# EAGLE design relay (EAGLE 9.6.2)
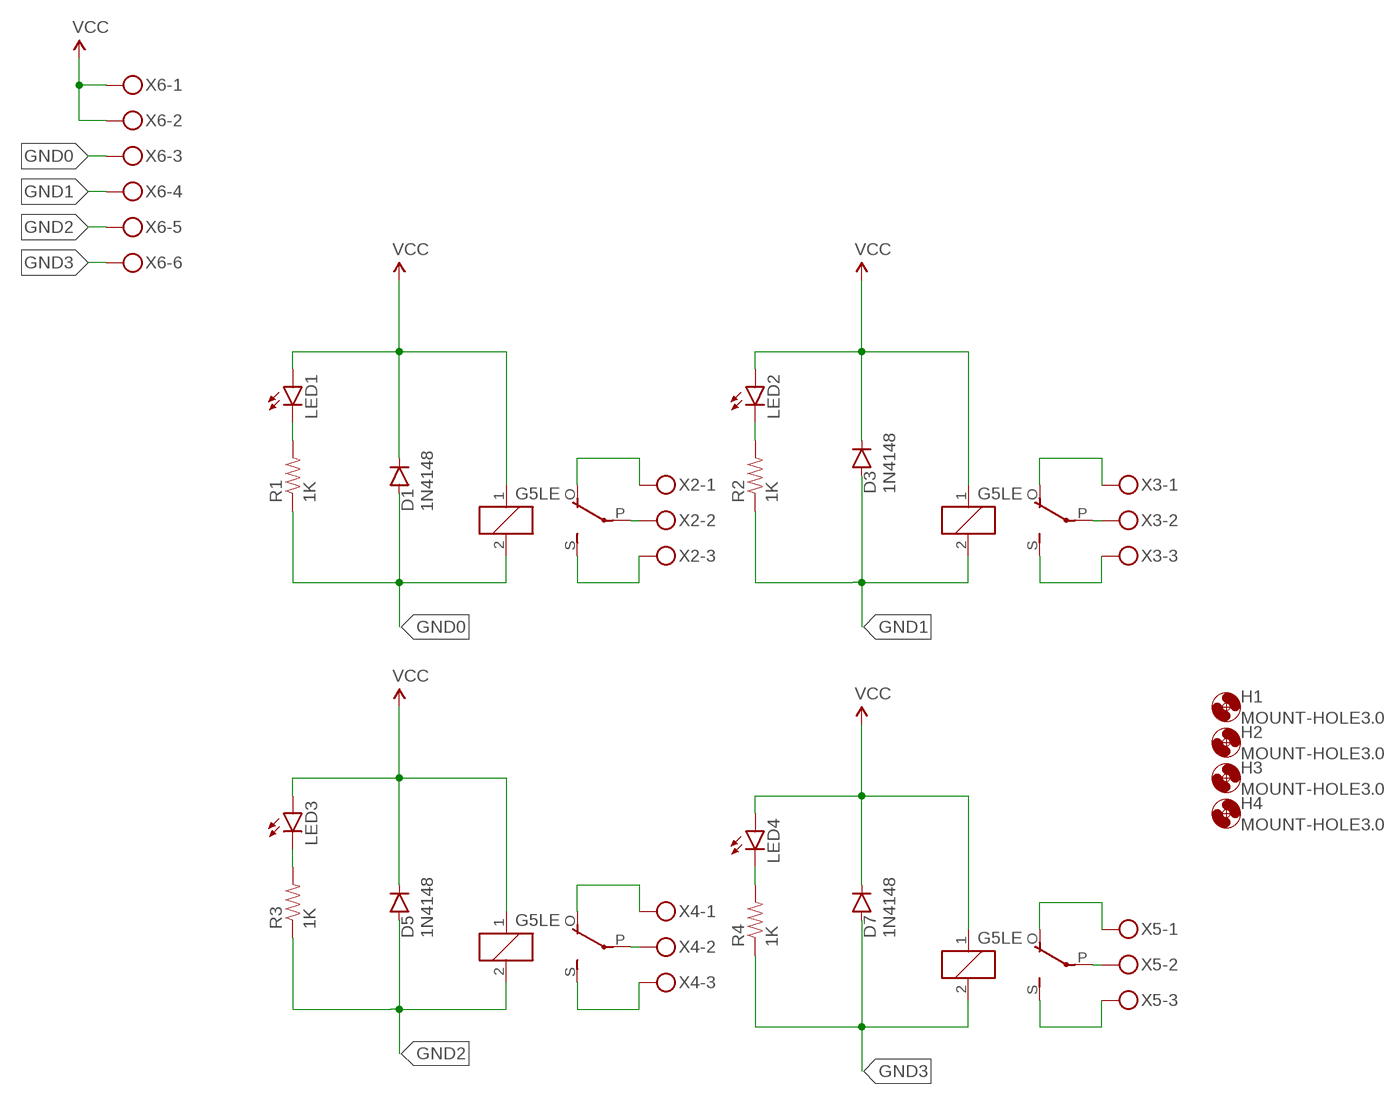
[diagram p0: schematic, sheet 1]

## Parts
D1  1N4148  DIODEKIT  [DIODE-1N4148-KIT]
D3  1N4148  DIODEKIT  [DIODE-1N4148-KIT]
D5  1N4148  DIODEKIT  [DIODE-1N4148-KIT]
D7  1N4148  DIODEKIT  [DIODE-1N4148-KIT]
H1  MOUNT-HOLE3.0  [3,0]
H2  MOUNT-HOLE3.0  [3,0]
H3  MOUNT-HOLE3.0  [3,0]
H4  MOUNT-HOLE3.0  [3,0]
K1  G5LE  [G5LE]
K2  G5LE  [G5LE]
K3  G5LE  [G5LE]
K4  G5LE  [G5LE]
LED1  LED3MM  [LED3MM]
LED2  LED3MM  [LED3MM]
LED3  LED3MM  [LED3MM]
LED4  LED3MM  [LED3MM]
R1  1K  1KOHM-1/4W-1%(PTH)HORIZ-KIT  [AXIAL-0.3EZ]
R2  1K  1KOHM-1/4W-1%(PTH)HORIZ-KIT  [AXIAL-0.3EZ]
R3  1K  1KOHM-1/4W-1%(PTH)HORIZ-KIT  [AXIAL-0.3EZ]
R4  1K  1KOHM-1/4W-1%(PTH)HORIZ-KIT  [AXIAL-0.3EZ]
X2  MKDSN1,5/3-5,08  [MKDSN1,5/3-5,08]
X3  MKDSN1,5/3-5,08  [MKDSN1,5/3-5,08]
X4  MKDSN1,5/3-5,08  [MKDSN1,5/3-5,08]
X5  MKDSN1,5/3-5,08  [MKDSN1,5/3-5,08]
X6  MKDSN1,5/6-5,08  [MKDSN1,5/6-5,08]

## Nets
GND0: D1.A K2.2 R1.P$1 X6.3
GND1: D3.A K1.2 R2.P$1 X6.4
GND2: D5.A K3.2 R3.P$1 X6.5
GND3: D7.A K4.2 R4.P$1 X6.6
N$1: K2.P(2:P) X2.2
N$2: K2.S(2:S) X2.3
N$3: K2.O(2:O) X2.1
N$4: LED2.K(C) R2.P$2
N$5: K1.P(2:P) X3.2
N$6: K1.S(2:S) X3.3
N$7: K1.O(2:O) X3.1
N$8: LED3.K(C) R3.P$2
N$9: LED1.K(C) R1.P$2
N$10: K3.P(2:P) X4.2
N$11: K3.S(2:S) X4.3
N$12: K3.O(2:O) X4.1
N$13: LED4.K(C) R4.P$2
N$14: K4.P(2:P) X5.2
N$15: K4.S(2:S) X5.3
N$16: K4.O(2:O) X5.1
VCC: D1.C D3.C D5.C D7.C K1.1 K2.1 K3.1 K4.1 LED1.A LED2.A LED3.A LED4.A X6.1 X6.2

## Library data of the parts
D1 D3 D5 D7 = SparkFun-DiscreteSemi:DIODE: Diode These are standard reverse protection diodes and small signal diodes. SMA package can handle up to about 1A. SOD-323 can handle about 200mA. What the SOD-323 package when ordering, there are some mfgs out there that are 5-pin packages.; PROD_ID: DIO-08378
H1-H4 = holes:MOUNT-HOLE: MOUNTING HOLE with drill center marker
K1-K4 = relay:G5LE: RELAY 1 x switch, 10 A/120 V AC, 8 A/30 V DC, Omron; OC_FARNELL: unknown; OC_NEWARK: unknown
LED1-LED4 = led:LED: LED OSRAM: - CHIPLED LG R971, LG N971, LY N971, LG Q971, LY Q971, LO R971, LY R971 LH N974, LH R974 LS Q976, LO Q976, LY Q976 LO Q996 - Hyper CHIPLED LW Q18S LB Q993, LB Q99A, LB R99A - SideLED LS A670, LO A670, LY A670, LG A670, LP A670 LB A673, LV A673, LT A673, LW A673 LH A674 LY A675 LS A676, LA A676, LO A676, LY A676, LW A676 LS A679, LY A679, LG A679 - Hyper Micro SIDELED® LS Y876, LA Y876, LO Y876, LY Y876 LT Y87S - SmartLED LW L88C, LW L88S LB L89C, LB L89S, LG L890 LS L89K, LO L89K, LY L89K LS L896, LA L896, LO L896, LY L896 - TOPLED LS T670, LO T670, LY T670, LG T670, LP T670 LSG T670, LSP T670, LSY T670, LOP T670, LYG T670 LG T671, LOG T671, LSG T671 LB T673, LV T673, LT T673, LW T673 LH T674 LS T676, LA T676, LO T676, LY T676, LB T676, LH T676, LSB T676, LW T676 LB T67C, LV T67C, LT T67C, LS T67K, LO T67K, LY T67K, LW E67C LS E67B, LA E67B, LO E67B, LY E67B, LB E67C, LV E67C, LT E67C LW T67C LS T679, LY T679, LG T679 LS T770, LO T770, LY T770, LG T770, LP T770 LB T773, LV T773, LT T773, LW T773 LH T774 LS E675, LA E675, LY E675, LS T675 LS T776, LA T776, LO T776, LY T776, LB T776 LHGB T686 LT T68C, LB T68C - Hyper Mini TOPLED® LB M676 - Mini TOPLED Santana® LG M470 LS M47K, LO M47K, LY M47K Source: http://www.osram.convergy.de LUXEON: - LUMILED® LXK2-PW12-R00, LXK2-PW12-S00, LXK2-PW14-U00, LXK2-PW14-V00 LXK2-PM12-R00, LXK2-PM12-S00, LXK2-PM14-U00 LXK2-PE12-Q00, LXK2-PE12-R00, LXK2-PE12-S00, LXK2-PE14-T00, LXK2-PE14-U00 LXK2-PB12-K00, LXK2-PB12-L00, LXK2-PB12-M00, LXK2-PB14-N00, LXK2-PB14-P00, LXK2-PB14-Q00 LXK2-PR12-L00, LXK2-PR12-M00, LXK2-PR14-Q00, LXK2-PR14-R00 LXK2-PD12-Q00, LXK2-PD12-R00, LXK2-PD12-S00 LXK2-PH12-R00, LXK2-PH12-S00 LXK2-PL12-P00, LXK2-PL12-Q00, LXK2-PL12-R00 Source: www.luxeon.com KINGBRIGHT: KA-3528ASYC Source: www.kingbright.com; PROD_ID: DIO-09529
R1-R4 = SparkFun-Resistors:1KOHM-1/4W-1%(PTH): RES-12182; PROD_ID: RES-12182
X2-X5 = con-phoenix-508:MKDSN1,5/3-5,08: MKDSN 1,5/ 3-5,08 Printklemme Nennstrom: 13,5 A Nennspannung: 250 V Rastermaß: 5,08 mm Polzahl: 3 Anschlussart: Schraubanschluss Montage: Löten Anschlussrichtung Leiter/Platine: 0 ° Artikelnummer: 1729131 Source: http://eshop.phoenixcontact.com .. 1729131.pdf
X6 = con-phoenix-508:MKDSN1,5/6-5,08: MKDSN 1,5/ 6-5,08 Printklemme Nennstrom: 13,5 A Nennspannung: 250 V Rastermaß: 5,08 mm Polzahl: 6 Anschlussart: Schraubanschluss Montage: Löten Anschlussrichtung Leiter/Platine: 0 ° Artikelnummer: 1729160 Source: http://eshop.phoenixcontact.com .. 1729160.pdf

## Board
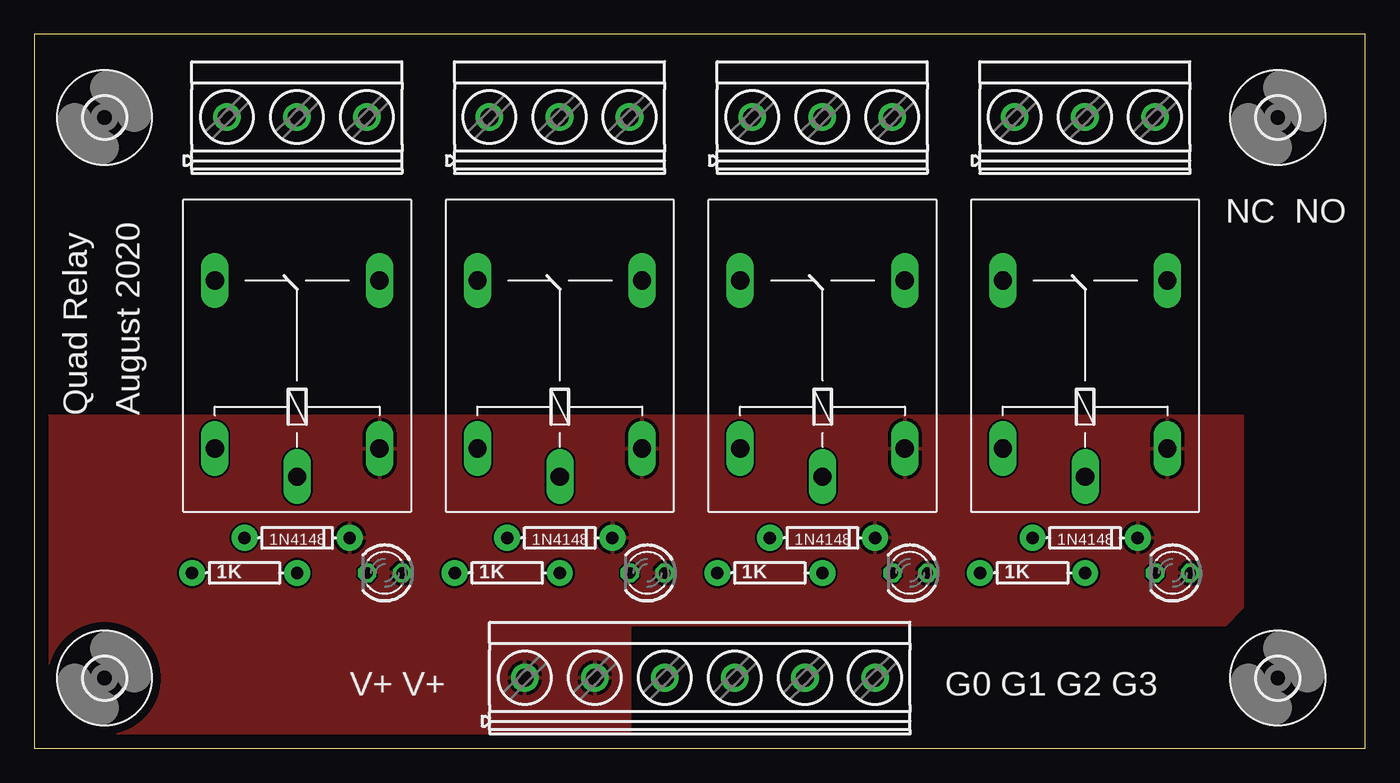
[diagram p1: board, top side]
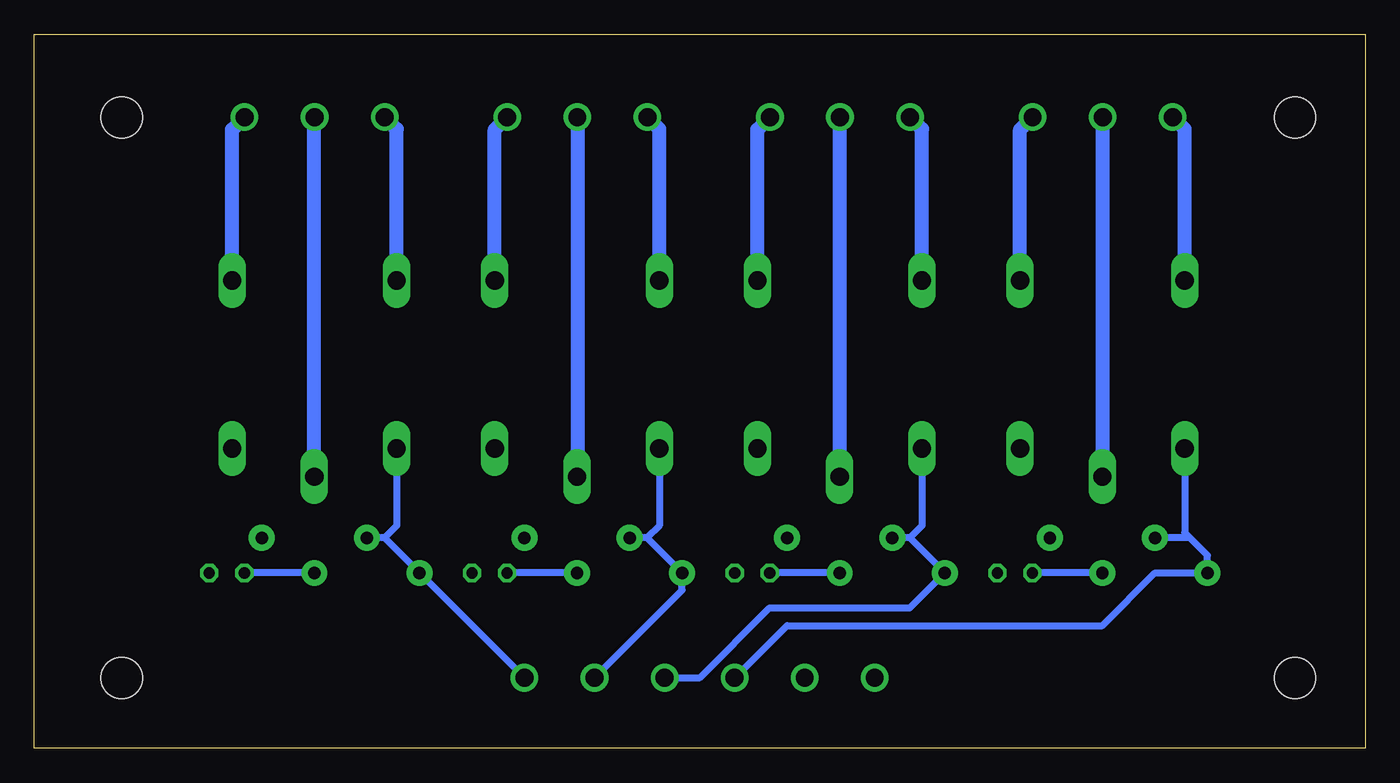
[diagram p2: board, bottom side, seen from below]

Size 96.5 x 51.74 mm. Coordinates in mm from the lower left corner, seen from the top.
Outline: 0,0 96.5,0 96.5,51.74 0,51.74 0,0
Copper layers (1*16): Top 0.035mm / dielectric 1.5mm / Bottom 0.035mm
Design rules "default": minimum track width 6mil, minimum drill 0.35mm, track to track 6mil, track to pad 6mil, pad to pad 6mil, via to via 6mil, smd to smd 6mil, copper to edge 40mil, drill to drill 6mil, minimum pad ring 10mil, minimum via ring 8mil, stop-mask expansion 4mil, vias tented up to drill 0mil, thermal gap 10mil

### Footprints (pad centres in the part's own frame; a part is rotated, then mirrored left to right if it is on the bottom)
DIODE-1N4148-KIT = drill 0.9 pad 1.88: A -3.81,0; C 3.81,0
3,0 = hole 3: 0,0
G5LE = drill 1.321 long: 1 -7.493,-5.969; 2 -7.493,5.969; O 4.699,5.969; P -9.525,0; S 4.699,-5.969
LED3MM = drill 0.813 octagon: A -1.27,0; K 1.27,0
AXIAL-0.3EZ = drill 0.9 pad 1.88: P$1 -3.81,0; P$2 3.81,0
MKDSN1,5/3-5,08 = drill 1.3 pad 2: 1 -7.641,0.025; 2 -2.561,0.025; 3 2.519,0.025
MKDSN1,5/6-5,08 = drill 1.3 pad 2: 1 -12.7,0.025; 2 -7.62,0.025; 3 -2.54,0.025; 4 2.54,0.025; 5 7.62,0.025; 6 12.7,0.025

### Placement (x,y rotation side)
D1  19.05,15.24 0 top
D3  38.1,15.24 0 top
D5  57.15,15.24 0 top
D7  76.2,15.24 0 top
H1  5.08,45.72 0 top
H2  90.17,45.72 0 top
H3  5.08,5.08 0 top
H4  90.17,5.08 0 top
K1  38.1,29.21 90 top
K2  19.05,29.21 90 top
K3  57.15,29.21 90 top
K4  76.2,29.21 90 top
LED1  25.4,12.7 180 top
LED2  44.45,12.7 180 top
LED3  63.5,12.7 180 top
LED4  82.55,12.7 180 top
R1  15.24,12.7 0 top
R2  34.29,12.7 0 top
R3  53.34,12.7 0 top
R4  72.39,12.7 0 top
X2  21.59,45.72 0 top
X3  40.64,45.72 0 top
X4  59.69,45.72 0 top
X5  78.74,45.72 0 top
X6  48.26,5.08 0 top

### Tracks (layer width: path | path; a pad name or v marks a point on that pad's centre or on a via)
GND0
  Bottom 0.508: X6.3 45.7,5.11 41.91,8.89 19.05,8.89 15.24,12.7 R1.P$1 11.43,13.97 12.7,15.24 | 12.7,15.24 D1.A | K2.2 13.08,15.62 12.7,15.24
GND1
  Bottom 0.508: X6.4 48.23,5.11 43.18,10.16 33.02,10.16 R2.P$1 33.02,15.24 | 33.02,15.24 D3.A | K1.2 32.13,16.13 33.02,15.24
GND2
  Bottom 0.508: X6.5 49.53,11.46 R3.P$1 52.07,15.24 | 52.07,15.24 D5.A | K3.2 51.18,16.13 52.07,15.24
GND3
  Bottom 0.508: X6.6 68.56,12.7 R4.P$1 71.12,15.24 | 71.12,15.24 D7.A | K4.2 70.23,16.13 71.12,15.24
N$1
  Bottom 1.016: X2.2 19.05,45.72 K2.P
N$2
  Bottom 1.016: K2.S 25.02,44.84 X2.3
N$3
  Bottom 1.016: K2.O 13.08,44.88 X2.1
N$4
  Bottom 0.508: R2.P$2 LED2.K
N$5
  Bottom 1.016: X3.2 38.1,45.72 K1.P
N$6
  Bottom 1.016: K1.S 44.07,44.84 X3.3
N$7
  Bottom 1.016: K1.O 32.13,44.88 X3.1
N$8
  Bottom 0.508: R3.P$2 LED3.K
N$9
  Bottom 0.508: R1.P$2 LED1.K
N$10
  Bottom 1.016: X4.2 57.13,19.71 K3.P
N$11
  Bottom 1.016: K3.S 63.12,44.84 X4.3
N$12
  Bottom 1.016: K3.O 51.18,44.88 X4.1
N$13
  Bottom 0.508: R4.P$2 LED4.K
N$14
  Bottom 1.016: X5.2 76.2,45.72 K4.P
N$15
  Bottom 1.016: K4.S 82.17,44.84 X5.3
N$16
  Bottom 1.016: K4.O 70.23,44.88 X5.1
VCC
  pour Top: -1.27,24.13 87.63,24.13 87.63,10.16 86.36,8.89 43.18,8.89 43.18,-2.54 -1.27,-2.54

### Text on the board
tNames: NC NO | Quad Relay | August 2020 | V+ V+ | G0 G1 G2 G3